# EAGLE schematic ArduinoPCB_test (EAGLE 9.5.0)
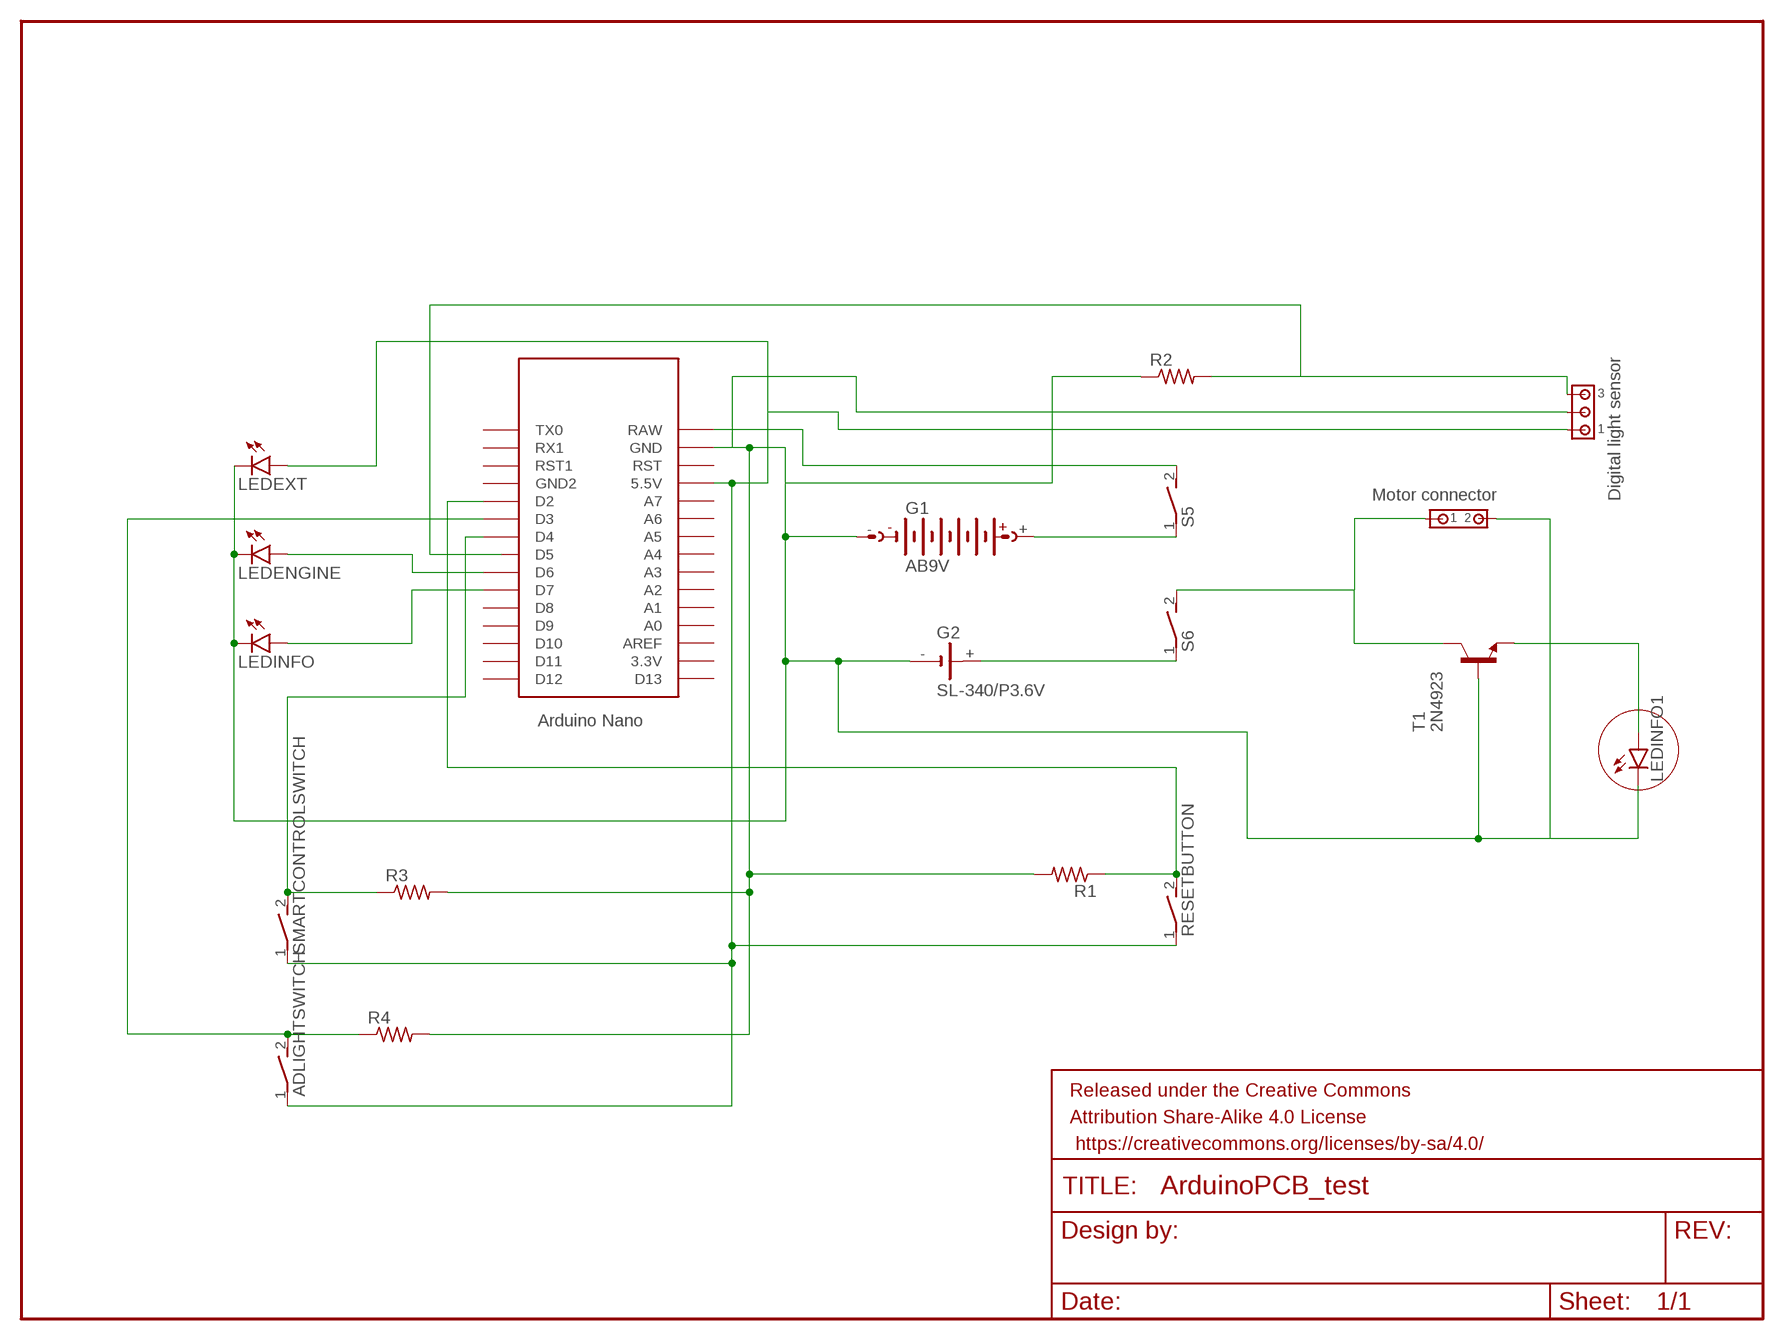
[diagram p0: schematic, sheet 1]

## Parts
ADLIGHTSWITCH  DS01E  [DS-01]
FRAME1  FRAME-LETTER  [CREATIVE_COMMONS]
G1  AB9V  [AB9V]
G2  SL-340/P3.6V  [SL-340/P3.6V]
J1  794681-2  [794681-2]
J2  1445055-3  [1445055-3]
LEDENGINE  LED3MM  [LED3MM]
LEDEXT  LED3MM  [LED3MM]
LEDINFO  LED3MM  [LED3MM]
LEDINFO1  LED3MM  [LED3MM]
R1  R-US_0309/12  [0309/12]
R2  R-US_0309/12  [0309/12]
R3  R-US_0309/12  [0309/12]
R4  R-US_0309/12  [0309/12]
RESETBUTTON  DS01E  [DS-01]
S5  DS01E  [DS-01]
S6  DS01E  [DS-01]
SMARTCONTROLSWITCH  DS01E  [DS-01]
T1  2N4923  [TO126]
U$1  NANO  [NANO]

## Nets
N$1: ADLIGHTSWITCH.2 R4.1 U$1.D3
N$2: R3.1 SMARTCONTROLSWITCH.2 U$1.D4
N$3: G2.+ S6.1
N$4: G1.+ S5.1
N$5: LEDINFO1.A T1.1(E)
N$8: G1.- G2.- J1.2 J2.2 LEDENGINE.K(C) LEDEXT.K(C) LEDINFO1.K(C) LEDINFO.K(C) R1.2 R2.1 R3.2 R4.2 T1.3(B) U$1.GND
N$9: ADLIGHTSWITCH.1 J2.1 LEDEXT.A RESETBUTTON.1 SMARTCONTROLSWITCH.1 U$1.5V(5.5V)
N$10: LEDENGINE.A U$1.D6
N$11: LEDINFO.A U$1.D7
N$12: S5.2 U$1.RAW
N$13: J2.3 R2.2
N$14: R1.1 RESETBUTTON.2 U$1.D2
N$16: J1.1 S6.2 T1.2(C)
Unconnected: U$1.3.3V U$1.A0 U$1.A1 U$1.A2 U$1.A3 U$1.A4 U$1.A5 U$1.A6 U$1.A7 U$1.AREF U$1.D5 U$1.D8 U$1.D9 U$1.D10 U$1.D11 U$1.D12 U$1.D13 U$1.GND1(GND2) U$1.ICSP1 U$1.ICSP2 U$1.ICSP3 U$1.ICSP4 U$1.ICSP5 U$1.ICSP6 U$1.RST U$1.RST1 U$1.RX1 U$1.TX0

## Library data of the parts
ADLIGHTSWITCH RESETBUTTON S5 S6 SMARTCONTROLSWITCH = switch-dil:DS01E: DIL/CODE SWITCH; OC_FARNELL: unknown; OC_NEWARK: unknown
FRAME1 = SparkFun-Aesthetics:FRAME-LETTER: Schematic Frame - Letter Standard 8.5x11 US Letter frame
G1 = battery:AB9V: 9-V BATTERY CLIP
G2 = battery:SL-340/P3.6V: LI BATTERY Sonnenschein
J1 = con-amp:794681-2: Micro MATE-N-LOK Connectors grid 1.5mm Dual Row Through Hole Vertical Metal Through Hole Holddowns Source: ENG_CD_794681_E.pdf
J2 = con-amp:1445055-3: Micro MATE-N-LOK Connectors grid 1.5 mm Source: ENG_CD_1445055_A.pdf
LEDENGINE LEDEXT LEDINFO LEDINFO1 = led:LED: LED OSRAM: - CHIPLED LG R971, LG N971, LY N971, LG Q971, LY Q971, LO R971, LY R971 LH N974, LH R974 LS Q976, LO Q976, LY Q976 LO Q996 - Hyper CHIPLED LW Q18S LB Q993, LB Q99A, LB R99A - SideLED LS A670, LO A670, LY A670, LG A670, LP A670 LB A673, LV A673, LT A673, LW A673 LH A674 LY A675 LS A676, LA A676, LO A676, LY A676, LW A676 LS A679, LY A679, LG A679 - Hyper Micro SIDELED® LS Y876, LA Y876, LO Y876, LY Y876 LT Y87S - SmartLED LW L88C, LW L88S LB L89C, LB L89S, LG L890 LS L89K, LO L89K, LY L89K LS L896, LA L896, LO L896, LY L896 - TOPLED LS T670, LO T670, LY T670, LG T670, LP T670 LSG T670, LSP T670, LSY T670, LOP T670, LYG T670 LG T671, LOG T671, LSG T671 LB T673, LV T673, LT T673, LW T673 LH T674 LS T676, LA T676, LO T676, LY T676, LB T676, LH T676, LSB T676, LW T676 LB T67C, LV T67C, LT T67C, LS T67K, LO T67K, LY T67K, LW E67C LS E67B, LA E67B, LO E67B, LY E67B, LB E67C, LV E67C, LT E67C LW T67C LS T679, LY T679, LG T679 LS T770, LO T770, LY T770, LG T770, LP T770 LB T773, LV T773, LT T773, LW T773 LH T774 LS E675, LA E675, LY E675, LS T675 LS T776, LA T776, LO T776, LY T776, LB T776 LHGB T686 LT T68C, LB T68C - Hyper Mini TOPLED® LB M676 - Mini TOPLED Santana® LG M470 LS M47K, LO M47K, LY M47K Source: http://www.osram.convergy.de LUXEON: - LUMILED® LXK2-PW12-R00, LXK2-PW12-S00, LXK2-PW14-U00, LXK2-PW14-V00 LXK2-PM12-R00, LXK2-PM12-S00, LXK2-PM14-U00 LXK2-PE12-Q00, LXK2-PE12-R00, LXK2-PE12-S00, LXK2-PE14-T00, LXK2-PE14-U00 LXK2-PB12-K00, LXK2-PB12-L00, LXK2-PB12-M00, LXK2-PB14-N00, LXK2-PB14-P00, LXK2-PB14-Q00 LXK2-PR12-L00, LXK2-PR12-M00, LXK2-PR14-Q00, LXK2-PR14-R00 LXK2-PD12-Q00, LXK2-PD12-R00, LXK2-PD12-S00 LXK2-PH12-R00, LXK2-PH12-S00 LXK2-PL12-P00, LXK2-PL12-Q00, LXK2-PL12-R00 Source: www.luxeon.com KINGBRIGHT: KA-3528ASYC Source: www.kingbright.com
R1-R4 = rcl:R-US_: RESISTOR, American symbol; SPICEPREFIX: R
T1 = transistor:2N4923: NPN TRANSISTOR
U$1 = Arduino-clone:NANO: Arduino Nano